# Altium project DDS_PCB.PrjPcb
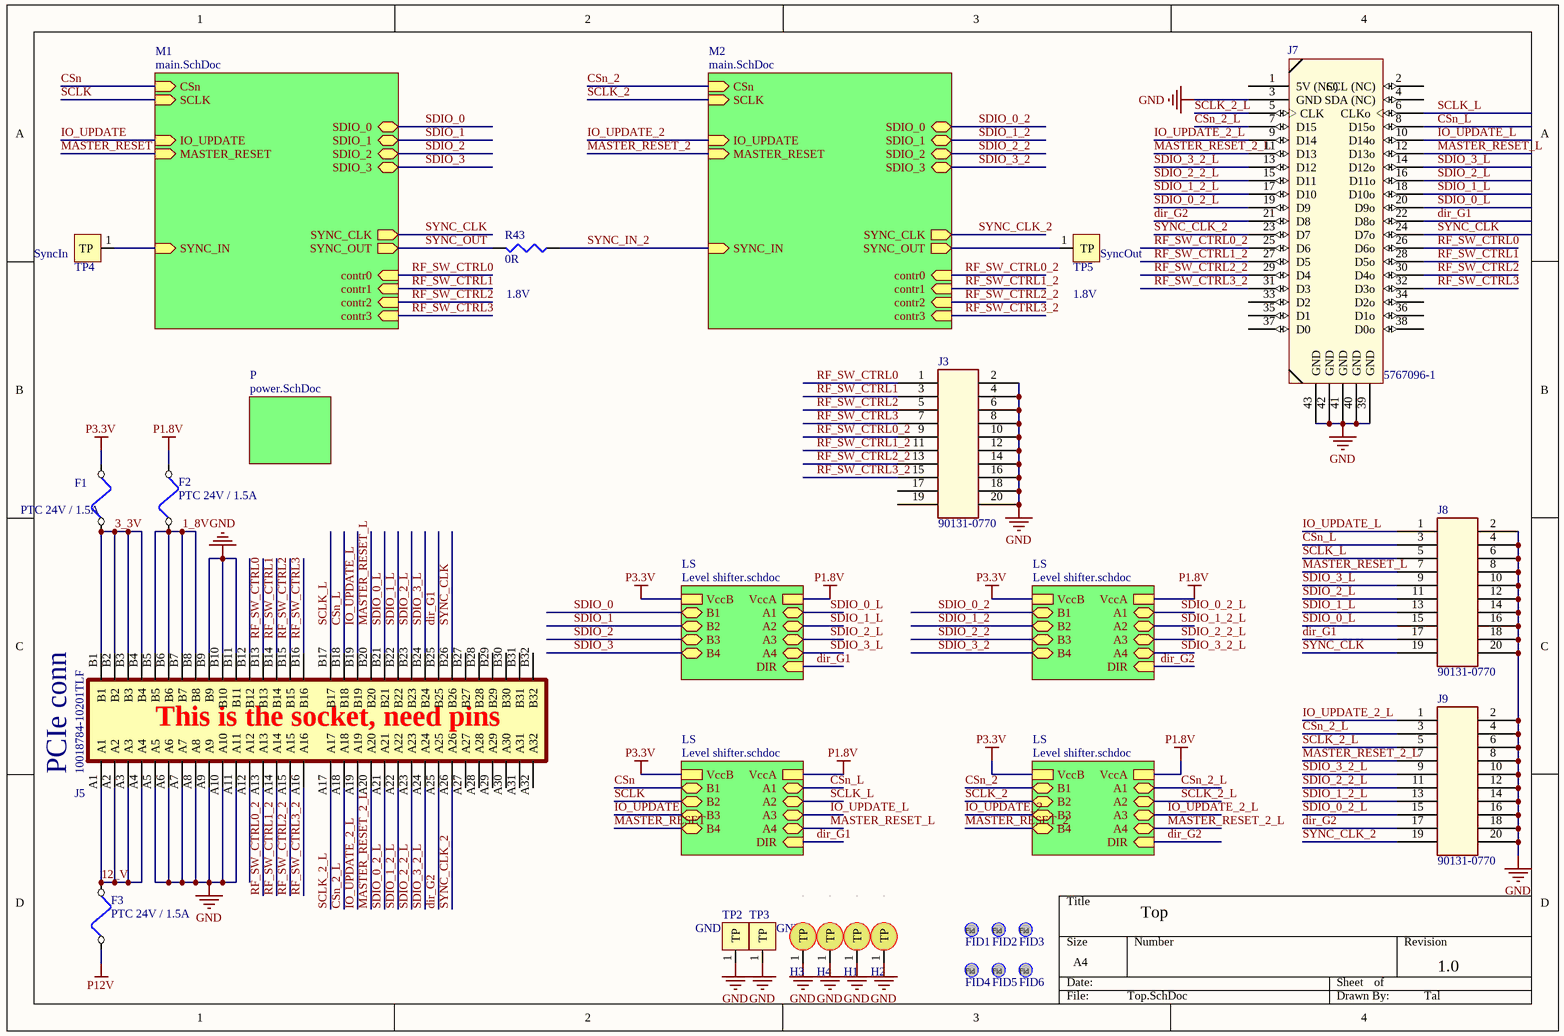
[diagram p0: Top.SchDoc]
4 sheets, 379 parts. Net scope: hierarchical (ports join the sheet entries above them; power ports are global).
Board file: DDS_PCB.PcbDoc
Sheets:
  Top.SchDoc
    M1 = main.SchDoc
      A0 = analog_channel.SchDoc
      A1 = analog_channel.SchDoc
      A2 = analog_channel3.SchDoc
      A3 = analog_channel3.SchDoc
    M2 = main.SchDoc
      A0 = analog_channel.SchDoc
      A1 = analog_channel.SchDoc
      A2 = analog_channel3.SchDoc
      A3 = analog_channel3.SchDoc

## Sheet Top.SchDoc
size A4; SheetNumber: 1; SheetTotal: 6

### Parts
F1  PTC 24V / 1.5A  [1812_F]
F2  PTC 24V / 1.5A  [1812_F]
F3  PTC 24V / 1.5A  [1812_F]
FID1  Fiducial  [Fiducial]  (value not drawn)
FID2  Fiducial  [Fiducial]  (value not drawn)
FID3  Fiducial  [Fiducial]  (value not drawn)
FID4  Fiducial  [Fiducial]  (value not drawn)
FID5  Fiducial  [Fiducial]  (value not drawn)
FID6  Fiducial  [Fiducial]  (value not drawn)
H1  Hole 3mm  [hole 3mm]  (value not drawn)
H2  Hole 3mm  [hole 3mm]  (value not drawn)
H3  Hole 3mm  [hole 3mm]  (value not drawn)
H4  Hole 3mm  [hole 3mm]  (value not drawn)
J3  90131-0770  [HEADER_10x2]
J5  10018784-10201TLF  [PCIE_8LANE_EDGE]
J7  5767096-1  [MICTOR-38_PIN]
J8  90131-0770  [HEADER_10x2]
J9  90131-0770  [HEADER_10x2]
R43  0R  [R0402]
TP2  GND  [TP_2x1.8]
TP3  GND  [TP_2x1.8]
TP4  SyncIn  [TP_2x1.8]
TP5  SyncOut  [TP_2x1.8]

### Sub-sheets
LS = Level shifter.schdoc (file not in this document): A4 (bidir), B3 (bidir), A2 (bidir), B1 (bidir), B4 (bidir), A1 (bidir), B2 (bidir), A3 (bidir), VccA, VccB, DIR (in)
LS = Level shifter.schdoc (file not in this document): A4 (bidir), B3 (bidir), A2 (bidir), B1 (bidir), B4 (bidir), A1 (bidir), B2 (bidir), A3 (bidir), VccA, VccB, DIR (in)
LS = Level shifter.schdoc (file not in this document): A4 (bidir), B3 (bidir), A2 (bidir), B1 (bidir), B4 (bidir), A1 (bidir), B2 (bidir), A3 (bidir), VccA, VccB, DIR (in)
LS = Level shifter.schdoc (file not in this document): A4 (bidir), B3 (bidir), A2 (bidir), B1 (bidir), B4 (bidir), A1 (bidir), B2 (bidir), A3 (bidir), VccA, VccB, DIR (in)
M1 = main.SchDoc: SYNC_CLK (out), SYNC_OUT (out), SDIO_0 (bidir), SDIO_1 (bidir), SDIO_2 (bidir), SDIO_3 (bidir), CSn (in), IO_UPDATE (in), MASTER_RESET (in), SCLK (in), SYNC_IN (in), contr0 (in), contr1 (in), contr2 (in), contr3 (in)
M2 = main.SchDoc: SYNC_CLK (out), SYNC_OUT (out), SDIO_0 (bidir), SDIO_1 (bidir), SDIO_2 (bidir), SDIO_3 (bidir), CSn (in), IO_UPDATE (in), MASTER_RESET (in), SCLK (in), SYNC_IN (in), contr0 (in), contr1 (in), contr2 (in), contr3 (in)
P = power.SchDoc (file not in this document): no entries

### Nets
GND: H1.1(TP) H2.1(TP) H3.1(TP) H4.1(TP) J3.2 J3.4 J3.6 J3.8 J3.10 J3.12 J3.14 J3.16 J3.18 J3.20 J5.A5 J5.A6 J5.A7 J5.A8 J5.A9 J5.A10 J5.A11 J5.B9 J5.B10 J5.B11 J7.3(GND) J7.39(GND) J7.40(GND) J7.41(GND) J7.42(GND) J7.43(GND) J8.2 J8.4 J8.6 J8.8 J8.10 J8.12 J8.14 J8.16 J8.18 J8.20 J9.2 J9.4 J9.6 J9.8 J9.10 J9.12 J9.14 J9.16 J9.18 J9.20 TP2.1(TP) TP3.1(TP)
P1.8V: F2.2 ; sheet LS/VccA, sheet LS/VccA, sheet LS/VccA, sheet LS/VccA
P3.3V: F1.2 ; sheet LS/VccB, sheet LS/VccB, sheet LS/VccB, sheet LS/VccB
P12V: F3.1
1_8V: F2.1 J5.B5 J5.B6 J5.B7 J5.B8
3_3V: F1.1 J5.B1 J5.B2 J5.B3 J5.B4
12_V: F3.2 J5.A1 J5.A2 J5.A3 J5.A4
CSn: sheet M1/CSn, sheet LS/B1
CSn_2: sheet M2/CSn, sheet LS/B1
CSn_2_L: J5.A18 J7.7(D15) J9.3 ; sheet LS/A1
CSn_L: J5.B18 J7.8(D15o) J8.3 ; sheet LS/A1
dir_G1: J5.B25 J7.22(D8o) J8.17 ; sheet LS/DIR, sheet LS/DIR
dir_G2: J5.A25 J7.21(D8) J9.17 ; sheet LS/DIR, sheet LS/DIR
IO_UPDATE: sheet M1/IO_UPDATE, sheet LS/B3
IO_UPDATE_2: sheet M2/IO_UPDATE, sheet LS/B3
IO_UPDATE_2_L: J5.A19 J7.9(D14) J9.1 ; sheet LS/A3
IO_UPDATE_L: J5.B19 J7.10(D14o) J8.1 ; sheet LS/A3
MASTER_RESET: sheet M1/MASTER_RESET, sheet LS/B4
MASTER_RESET_2: sheet M2/MASTER_RESET, sheet LS/B4
MASTER_RESET_2_L: J5.A20 J7.11(D13) J9.7 ; sheet LS/A4
MASTER_RESET_L: J5.B20 J7.12(D13o) J8.7 ; sheet LS/A4
RF_SW_CTRL0: J3.1 J5.B13 J7.26(D6o) ; sheet M1/contr0  [project net contr0]
RF_SW_CTRL0_2: J3.9 J5.A13 J7.25(D6) ; sheet M2/contr0  [project net contr0]
RF_SW_CTRL1: J3.3 J5.B14 J7.28(D5o) ; sheet M1/contr1  [project net contr1]
RF_SW_CTRL1_2: J3.11 J5.A14 J7.27(D5) ; sheet M2/contr1  [project net contr1]
RF_SW_CTRL2: J3.5 J5.B15 J7.30(D4o) ; sheet M1/contr2  [project net contr2]
RF_SW_CTRL2_2: J3.13 J5.A15 J7.29(D4) ; sheet M2/contr2  [project net contr2]
RF_SW_CTRL3: J3.7 J5.B16 J7.32(D3o) ; sheet M1/contr3  [project net contr3]
RF_SW_CTRL3_2: J3.15 J5.A16 J7.31(D3) ; sheet M2/contr3  [project net contr3]
SCLK: sheet M1/SCLK, sheet LS/B2
SCLK_2: sheet M2/SCLK, sheet LS/B2
SCLK_2_L: J5.A17 J7.5(CLK) J9.5 ; sheet LS/A2
SCLK_L: J5.B17 J7.6(CLKo) J8.5 ; sheet LS/A2
SDIO_0: sheet M1/SDIO_0, sheet LS/B1
SDIO_0_2: sheet M2/SDIO_0, sheet LS/B1
SDIO_0_2_L: J5.A21 J7.19(D9) J9.15 ; sheet LS/A1
SDIO_0_L: J5.B21 J7.20(D9o) J8.15 ; sheet LS/A1
SDIO_1: sheet M1/SDIO_1, sheet LS/B2
SDIO_1_2: sheet M2/SDIO_1, sheet LS/B2
SDIO_1_2_L: J5.A22 J7.17(D10) J9.13 ; sheet LS/A2
SDIO_1_L: J5.B22 J7.18(D10o) J8.13 ; sheet LS/A2
SDIO_2: sheet M1/SDIO_2, sheet LS/B3
SDIO_2_2: sheet M2/SDIO_2, sheet LS/B3
SDIO_2_2_L: J5.A23 J7.15(D11) J9.11 ; sheet LS/A3
SDIO_2_L: J5.B23 J7.16(D11o) J8.11 ; sheet LS/A3
SDIO_3: sheet M1/SDIO_3, sheet LS/B4
SDIO_3_2: sheet M2/SDIO_3, sheet LS/B4
SDIO_3_2_L: J5.A24 J7.13(D12) J9.9 ; sheet LS/A4
SDIO_3_L: J5.B24 J7.14(D12o) J8.9 ; sheet LS/A4
SYNC_CLK: J5.B26 J7.24(D7o) J8.19 ; sheet M1/SYNC_CLK
SYNC_CLK_2: J5.A26 J7.23(D7) J9.19 ; sheet M2/SYNC_CLK
SYNC_IN: TP4.1(TP) ; sheet M1/SYNC_IN
SYNC_IN_2: R43.1 ; sheet M2/SYNC_IN
SYNC_OUT: TP5.1(TP) ; sheet M2/SYNC_OUT
SYNC_OUT: R43.2 ; sheet M1/SYNC_OUT  [a separate net that carries the same name]

Not connected (* = marked no-connect by the designer): J3 17 19; J5 A12 A27 A28 A29 A30 A31 A32 B12 B27 B28 B29 B30 B31 B32; J7 1(5V_(NC)) 2(SCL_(NC)) 4(SDA_(NC)) 33(D2) 34(D2o) 35(D1) 36(D1o) 37(D0) 38(D0o)

### Notes on the sheet
- (near R43) 1.8V
- (near TP5) 1.8V
- (near J5) PCIe conn
- (near J5) This is the socket, need pins
- Top
- 1.0
- Tal
- (in symbol Fiducial) Fid

### Library data of the parts
F1-F3 = 1812L150/24MR: FUSE PTC 24V 1.5A POLYFUSE 1812; Manufacturer: Littelfuse Inc; LANDA P/N: EFS-000011; Package / Case: 1812 (4532 Metric), Concave; RoHS: RoHS Compliant; Manufacturer Part Number: 1812L150/24MR; ComponentLink1URL: http://www.littelfuse.com/data/en/Data_Sheets/Littelfuse_PTC_1812L.pdf; ComponentLink1Description: http://www.littelfuse.com/data/en/Data_Sheets/Littelfuse_PTC_1812L.pdf; Current - Hold (Ih) (Max): 1.5A
FID1-FID6 = Fiducial: Assembly: NA
J3 J8 J9 = 90131-0770: CONN HEADER 20 TH; Manufacturer: Molex Connector Corporation; LANDA P/N: ECN-000005; RoHS: RoHS Compliant; Mounting Type: Through Hole; Contact Type: Male Pin; ComponentLink1URL: http://www.molex.com/pdm_docs/sd/901310770_sd.pdf; ComponentLink1Description: http://www.molex.com/pdm_docs/sd/901310770_sd.pdf; Manufacturer Part Number: 90131-0770
J5 = 10018784-10201TLF: 64 Position Female Connector PCI Expressâ„¢ Gold 0.039 _1.00mm_ Black; MF: Amphenol ICC; Price: None; Value: *; MP: 10018784-10201TLF; Package: None; SnapEDA_Link: https://www.snapeda.com/parts/10018784-10201TLF/Amphenol%20FCI/view-part/2598016/?ref=snap; Availability: Unavailable
J7 = 5767096-1: CONN MICTOR 38POS .025 VERT SMD; Manufacturer: TE Connectivity; LANDA P/N: ECN-000060; RoHS: RoHS Compliant; ComponentLink1URL: http://www.te.com/commerce/DocumentDelivery/DDEController?Action=srchrtrv&DocNm=5767096&DocType=Customer+Drawing&DocLang=English; ComponentLink1Description: http://www.te.com/commerce/DocumentDelivery/DDEController?Action=srchrtrv&DocNm=5767096&DocType=Customer+Drawing&DocLang=English; Manufacturer Part Number: 5767096-1
R43 = RES 100 OHM 1/10W 1% 0402 SMD: RES 0 OHM 1/10W 1% 0402 SMD; Manufacturer Part Number: ERJ-2RKF1000X; Manufacturer: Panasonic Electronic Components; LANDA P/N: ERS-000079; Assembly: N.C; Package / Case: 0402 (1005 Metric); RoHS: RoHS Compliant; ComponentLink1URL: http://industrial.panasonic.com/www-cgi/jvcr13pz.cgi?E+PZ+3+AOA0002+ERJ2RKF1000X+7+WW; ComponentLink1Description: http://industrial.panasonic.com/www-cgi/jvcr13pz.cgi?E+PZ+3+AOA0002+ERJ2RKF1000X+7+WW; Supplier Device Package: 0402
TP2 TP4 TP5 = TP mini_2: TP PC MINIATURE SMT; Manufacturer: Keystone Electronics; Manufacturer Part Number: 5015; Assembly: N.A; LANDA P/N: ECN-000032; RoHS: RoHS Compliant
TP3 = TP mini_1: TP PC MINIATURE SMT; Manufacturer: Keystone Electronics; Manufacturer Part Number: 5015; Assembly: N.A; LANDA P/N: ECN-000032; RoHS: RoHS Compliant

## Sheet main.SchDoc
size A4; SheetNumber: 2; SheetTotal: 6; SPICEModelCacheQOCYWOGJ: <root> / <DocumentId>QOCYWOGJ</DocumentId> / </root>
Used 2 times, as channels M1, M2. Parts and nets are listed once, with the designators drawn on the sheet.
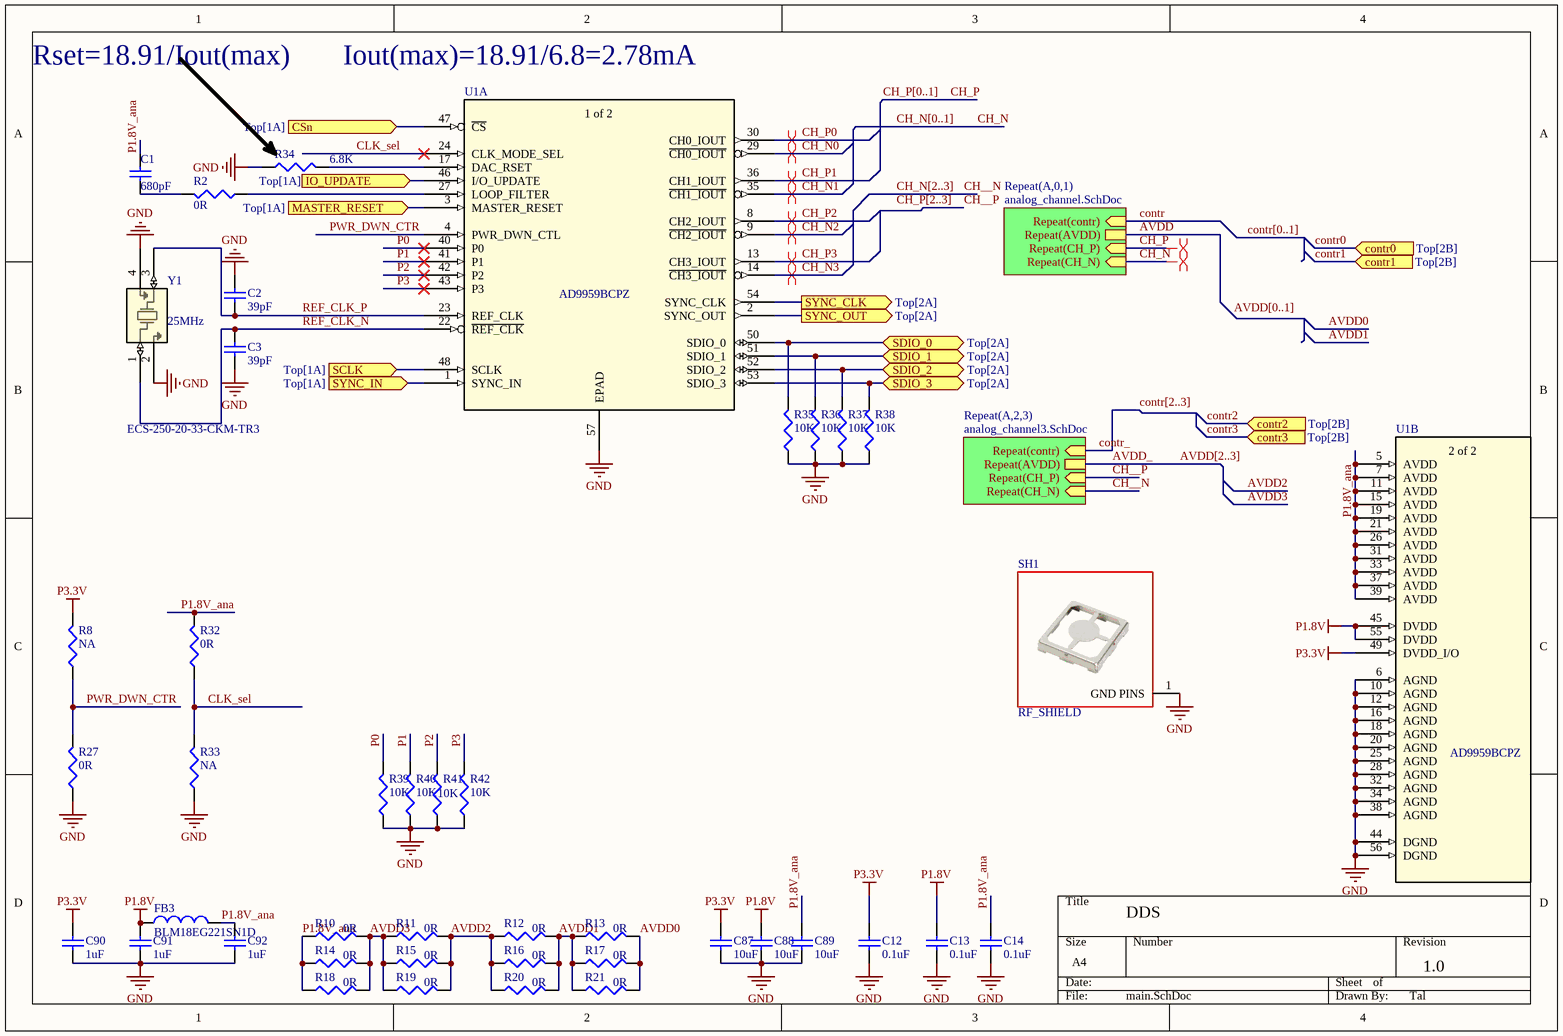
[diagram p1: main.SchDoc]

### Parts
C1  Capacitance: 680pF  [C0402]  (hidden comment: 680pF 50V)
C2  Capacitance: 39pF  [C0402]  (hidden comment: 39pF 50V)
C3  Capacitance: 39pF  [C0402]  (hidden comment: 39pF 50V)
C12  Capacitance: 0.1uF  [C0402]  (hidden comment: 0.1uF 50V)
C13  Capacitance: 0.1uF  [C0402]  (hidden comment: 0.1uF 50V)
C14  Capacitance: 0.1uF  [C0402]  (hidden comment: 0.1uF 50V)
C87  Capacitance: 10uF  [C0402]  (hidden comment: 10uF 10V)
C88  Capacitance: 10uF  [C0402]  (hidden comment: 10uF 10V)
C89  Capacitance: 10uF  [C0402]  (hidden comment: 10uF 10V)
C90  Capacitance: 1uF  [C0402]  (hidden comment: 1uF 25V)
C91  Capacitance: 1uF  [C0402]  (hidden comment: 1uF 25V)
C92  Capacitance: 1uF  [C0402]  (hidden comment: 1uF 25V)
FB3  BLM18EG221SN1D  [fb0603]
R2  0R  [R0402]
R8  NA  [R0402]
R10  0R  [R0805]
R11  0R  [R0805]
R12  0R  [R0805]
R13  0R  [R0805]
R14  0R  [R0805]
R15  0R  [R0805]
R16  0R  [R0805]
R17  0R  [R0805]
R18  0R  [R0805]
R19  0R  [R0805]
R20  0R  [R0805]
R21  0R  [R0805]
R27  0R  [R0402]
R32  0R  [R0402]
R33  NA  [R0402]
R34  6.8K  [R0402]
R35  10K  [R0402]
R36  10K  [R0402]
R37  10K  [R0402]
R38  10K  [R0402]
R39  10K  [R0402]
R40  10K  [R0402]
R41  10K  [R0402]
R42  10K  [R0402]
SH1  RF_SHIELD  [SMS201F]
U1  AD9959BCPZ  [CP_56_1_ADI]  (parts A,B of 2)
Y1  ECS-250-20-33-CKM-TR3  [SMD4_ECX-32_3p2x2p5_ECS]

### Sub-sheets
Repeat(A,0,1) = analog_channel.SchDoc: Repeat(contr) (in), Repeat(AVDD), Repeat(CH_P) (in), Repeat(CH_N) (in)
Repeat(A,2,3) = analog_channel3.SchDoc: Repeat(contr) (in), Repeat(AVDD), Repeat(CH_P) (in), Repeat(CH_N) (in)

### Ports
contr0 (in, see Top[2B]), contr1 (in, see Top[2B]), contr2 (in, see Top[2B]), contr3 (in, see Top[2B]), CSn (in, see Top[1A]), IO_UPDATE (in, see Top[1A]), MASTER_RESET (in, see Top[1A]), SCLK (in, see Top[1A]), SDIO_0 (bidir, see Top[2A]), SDIO_1 (bidir, see Top[2A]), SDIO_2 (bidir, see Top[2A]), SDIO_3 (bidir, see Top[2A]), SYNC_CLK (out, see Top[2A]), SYNC_IN (in, see Top[1A]), SYNC_OUT (out, see Top[2A])

### Nets
GND: C2.2 C3.1 C12.1 C13.1 C14.1 C87.1 C88.1 C89.1 C90.1 C91.1 C92.1 R27.1 R33.1 R34.1 R35.1 R36.1 R37.1 R38.1 R39.1 R40.1 R41.1 R42.1 SH1.1(GND_PINS) U1.6(AGND) U1.10(AGND) U1.12(AGND) U1.16(AGND) U1.18(AGND) U1.20(AGND) U1.25(AGND) U1.28(AGND) U1.32(AGND) U1.34(AGND) U1.38(AGND) U1.44(DGND) U1.56(DGND) U1.57(EPAD) Y1.2 Y1.4
P1.8V: C13.2 C88.2 C91.2 FB3.1 U1.45(DVDD) U1.55(DVDD)
P3.3V: C12.2 C87.2 C90.2 R8.2 U1.49(DVDD_I/O)
AVDD: sheet Repeat(A,0,1)/Repeat(AVDD)
AVDD0: R13.2 R17.2 R21.2
AVDD1: R12.2 R13.1 R16.2 R17.1 R20.2 R21.1
AVDD2: R11.2 R12.1 R15.2 R16.1 R19.2 R20.1
AVDD3: R10.2 R11.1 R14.2 R15.1 R18.2 R19.1
AVDD[2..3]: sheet Repeat(A,2,3)/Repeat(AVDD)  [also labelled AVDD_]
CH__N: sheet Repeat(A,2,3)/Repeat(CH_N)
CH__P: sheet Repeat(A,2,3)/Repeat(CH_P)
CH_N: sheet Repeat(A,0,1)/Repeat(CH_N)
CH_N0: U1.29(~{CH0_IOUT})
CH_N1: U1.35(~{CH1_IOUT})
CH_N2: U1.9(~{CH2_IOUT})
CH_N3: U1.14(~{CH3_IOUT})
CH_P: sheet Repeat(A,0,1)/Repeat(CH_P)
CH_P0: U1.30(CH0_IOUT)
CH_P1: U1.36(CH1_IOUT)
CH_P2: U1.8(CH2_IOUT)
CH_P3: U1.13(CH3_IOUT)
CLK_sel: R32.1 R33.2 U1.24(CLK_MODE_SEL)
contr: sheet Repeat(A,0,1)/Repeat(contr)
contr0: port contr0
contr1: port contr1
contr2: port contr2
contr3: port contr3
contr[2..3]: sheet Repeat(A,2,3)/Repeat(contr)  [also labelled contr_]
CSn: U1.47(~{CS}) ; port CSn
IO_UPDATE: U1.46(I/O_UPDATE) ; port IO_UPDATE
MASTER_RESET: U1.3(MASTER_RESET) ; port MASTER_RESET
P0: R39.2 U1.40(P0)
P1: R40.2 U1.41(P1)
P1.8V_ana: C1.1 C14.2 C89.2 C92.2 FB3.2 R10.1 R14.1 R18.1 R32.2 U1.5(AVDD) U1.7(AVDD) U1.11(AVDD) U1.15(AVDD) U1.19(AVDD) U1.21(AVDD) U1.26(AVDD) U1.31(AVDD) U1.33(AVDD) U1.37(AVDD) U1.39(AVDD)
P2: R41.2 U1.42(P2)
P3: R42.2 U1.43(P3)
PWR_DWN_CTR: R8.1 R27.2 U1.4(PWR_DWN_CTL)
REF_CLK_N: C3.2 U1.22(~{REF_CLK}) Y1.1
REF_CLK_P: C2.1 U1.23(REF_CLK) Y1.3
SCLK: U1.48(SCLK) ; port SCLK
SDIO_0: R35.2 U1.50(SDIO_0) ; port SDIO_0
SDIO_1: R36.2 U1.51(SDIO_1) ; port SDIO_1
SDIO_2: R37.2 U1.52(SDIO_2) ; port SDIO_2
SDIO_3: R38.2 U1.53(SDIO_3) ; port SDIO_3
SYNC_CLK: U1.54(SYNC_CLK) ; port SYNC_CLK
SYNC_IN: U1.1(SYNC_IN) ; port SYNC_IN
SYNC_OUT: U1.2(SYNC_OUT) ; port SYNC_OUT
NetC1_2: C1.2 R2.2
NetR2_1: R2.1 U1.27(LOOP_FILTER)
NetR34_2: R34.2 U1.17(DAC_RSET)

### Channels
M1: designators end in _M1; ports contr0=contr0 contr1=contr1 contr2=contr2 contr3=contr3 CSn=CSn IO_UPDATE=IO_UPDATE MASTER_RESET=MASTER_RESET SCLK=SCLK SDIO_0=SDIO_0 SDIO_1=SDIO_1 SDIO_2=SDIO_2 SDIO_3=SDIO_3 SYNC_CLK=SYNC_CLK SYNC_IN=SYNC_IN SYNC_OUT=SYNC_OUT
M2: designators end in _M2; ports contr0=contr0 contr1=contr1 contr2=contr2 contr3=contr3 CSn=CSn_2 IO_UPDATE=IO_UPDATE_2 MASTER_RESET=MASTER_RESET_2 SCLK=SCLK_2 SDIO_0=SDIO_0_2 SDIO_1=SDIO_1_2 SDIO_2=SDIO_2_2 SDIO_3=SDIO_3_2 SYNC_CLK=SYNC_CLK_2 SYNC_IN=SYNC_IN_2 SYNC_OUT=SYNC_OUT

### Buses and harness runs
bus AVDD[0..1]
bus CH_N[0..1]
bus CH_N[2..3]
bus CH_P[0..1]
bus CH_P[2..3]
bus contr[0..1]

### Layout directives
differential pair: CH_N, CH_N2_M1, CH_N3_M1, CH_N_M1, CH_P, CH_P2_M1, CH_P3_M1, CH_P_M1

### Notes on the sheet
- Rset=18.91/Iout(max)
- Iout(max)=18.91/6.8=2.78mA
- (near Y1) 25MHz
- DDS
- 1.0
- Tal
- Labels drawn without touching a wire or pin: CH_P[2..3]
- (in symbol AD9959BCPZ, part A) 1 of 2
- (in symbol AD9959BCPZ, part B) 2 of 2

### Library data of the parts
C1 = CAP CER 6.8pF 50V NP0 0402: CAP CER 680PF 50V NP0 0402; Manufacturer Part Number: C1005C0G1H6R8D; Manufacturer: TDK Corporation; LANDA P/N: ECP-000033; RoHS: RoHS Compliant; Package / Case: 0402 (1005 Metric); ComponentLink1URL: http://www.tdk.com/pdf/general_B11.pdf; ComponentLink1Description: http://www.tdk.com/pdf/general_B11.pdf; Voltage - Rated: 50V
C2 C3 = CAP CER 6.8pF 50V NP0 0402: CAP CER 39PF 50V NP0 0402; Manufacturer Part Number: C1005C0G1H6R8D; Manufacturer: TDK Corporation; LANDA P/N: ECP-000033; RoHS: RoHS Compliant; Package / Case: 0402 (1005 Metric); ComponentLink1URL: http://www.tdk.com/pdf/general_B11.pdf; ComponentLink1Description: http://www.tdk.com/pdf/general_B11.pdf; Voltage - Rated: 50V
C12-C14 = CAP CER 6.8pF 50V NP0 0402: CAP CER 0.1uF 50V NP0 0402; Manufacturer Part Number: C1005C0G1H6R8D; Manufacturer: TDK Corporation; LANDA P/N: ECP-000033; RoHS: RoHS Compliant; Package / Case: 0402 (1005 Metric); ComponentLink1URL: http://www.tdk.com/pdf/general_B11.pdf; ComponentLink1Description: http://www.tdk.com/pdf/general_B11.pdf; Voltage - Rated: 50V
C87-C89 = CAP CER 6.8pF 50V NP0 0402: CAP CER 10uF 10V X5R 0402; Manufacturer Part Number: C1005C0G1H6R8D; Manufacturer: TDK Corporation; LANDA P/N: ECP-000033; Voltage - Rated: 50V; RoHS: RoHS Compliant; Package / Case: 0402 (1005 Metric); ComponentLink1URL: http://www.tdk.com/pdf/general_B11.pdf; ComponentLink1Description: http://www.tdk.com/pdf/general_B11.pdf
C90-C92 = CAP CER 6.8pF 50V NP0 0402: CAP CER 1uF 25V X5R 0402; Manufacturer Part Number: C1005C0G1H6R8D; Manufacturer: TDK Corporation; LANDA P/N: ECP-000033; Voltage - Rated: 50V; RoHS: RoHS Compliant; Package / Case: 0402 (1005 Metric); ComponentLink1URL: http://www.tdk.com/pdf/general_B11.pdf; ComponentLink1Description: http://www.tdk.com/pdf/general_B11.pdf
FB3 = BK1608HS600-T: FERRITE BEAD 220_OHM@100MHz 0603 2A 50mohm_DC; Manufacturer: Taiyo Yuden; LANDA P/N: EIN-000010; RoHS: RoHS Compliant; Package / Case: 0603 (1608 Metric); ComponentLink1URL: http://www.yuden.co.jp/ut/product/category/emisuppression/BK1608HS600-T.pdf; ComponentLink1Description: http://www.yuden.co.jp/ut/product/category/emisuppression/BK1608HS600-T.pdf; Manufacturer Part Number: BLM18EG221SN1D
R2 R8 R27 R32 R33 = RES 100 OHM 1/10W 1% 0402 SMD: as R43 on sheet Top; Package / Case: 0402 (1005 Metric); RoHS: RoHS Compliant; ComponentLink1URL: http://industrial.panasonic.com/www-cgi/jvcr13pz.cgi?E+PZ+3+AOA0002+ERJ2RKF1000X+7+WW; ComponentLink1Description: http://industrial.panasonic.com/www-cgi/jvcr13pz.cgi?E+PZ+3+AOA0002+ERJ2RKF1000X+7+WW; Supplier Device Package: 0402
R10-R21 = RES 200 OHM 1/8W 1% 0805 SMD: RES 0 OHM 1/8W 1% 0805 SMD; Manufacturer Part Number: RMCF0805FT200R; Manufacturer: Stackpole Electronics Inc; Power (Watts): 0.125W, 1/8W; LANDA P/N: ERS-000050; Package / Case: 0805 (2012 Metric); RoHS: RoHS Compliant; Supplier Device Package: 0805; ComponentLink1URL: http://www.seielect.com/Catalog/SEI-RMCF_RMCP.pdf; ComponentLink1Description: http://www.seielect.com/Catalog/SEI-RMCF_RMCP.pdf
R34 = RES 3.09K OHM 1/16W 1% 0402: RES 6.8K OHM 1/16W 1% 0402; Manufacturer Part Number: RMCF0402FT3K09; Manufacturer: Stackpole Electronics Inc; Power (Watts): 0.063W, 1/16W; LANDA P/N: ERS-000063; Supplier Device Package: 0402; Package / Case: 0402 (1005 Metric); RoHS: RoHS Compliant; ComponentLink1URL: http://www.seielect.com/Catalog/SEI-RMCF_RMCP.pdf; ComponentLink1Description: http://www.seielect.com/Catalog/SEI-RMCF_RMCP.pdf
R35-R42 = RES 3.09K OHM 1/16W 1% 0402: RES 10K OHM 1/16W 1% 0402; Manufacturer Part Number: RMCF0402FT3K09; Manufacturer: Stackpole Electronics Inc; Power (Watts): 0.063W, 1/16W; LANDA P/N: ERS-000063; Supplier Device Package: 0402; Package / Case: 0402 (1005 Metric); RoHS: RoHS Compliant; ComponentLink1URL: http://www.seielect.com/Catalog/SEI-RMCF_RMCP.pdf; ComponentLink1Description: http://www.seielect.com/Catalog/SEI-RMCF_RMCP.pdf
SH1 = RF_SHIELD: RF SHIELD 0.5" X 0.538" SMD; Manufacturer_Part_Number: SMS-201F; Manufacturer: Leader Tech Inc.; ComponentLink1Description: Datasheet; ComponentLink1URL: https://www.leadertechinc.com/assets/files/EngineeringDrawings/SMS-201.pdf
U1 = AD9959BCPZ: No Description Available; Mfr_Name: Analog Devices Inc; Copyright: Copyright (C) 2023 Ultra Librarian. All rights reserved.; Manufacturer_Part_Number: AD9959BCPZ; RefDes: RefDes; Type: DEV
Y1 = ECS-250-20-33-CKM-TR3: No Description Available; Mfr_Name: ECS International; Type: DEV; Copyright: Copyright (C) 2023 Ultra Librarian. All rights reserved.; Manufacturer_Part_Number: ECS-250-20-33-CKM-TR3; RefDes: RefDes

## Sheet analog_channel.SchDoc
size A4; SheetNumber: 4; SheetTotal: 6
Used 4 times, as channels M1/A0, M1/A1, M2/A0, M2/A1. Parts and nets are listed once, with the designators drawn on the sheet.
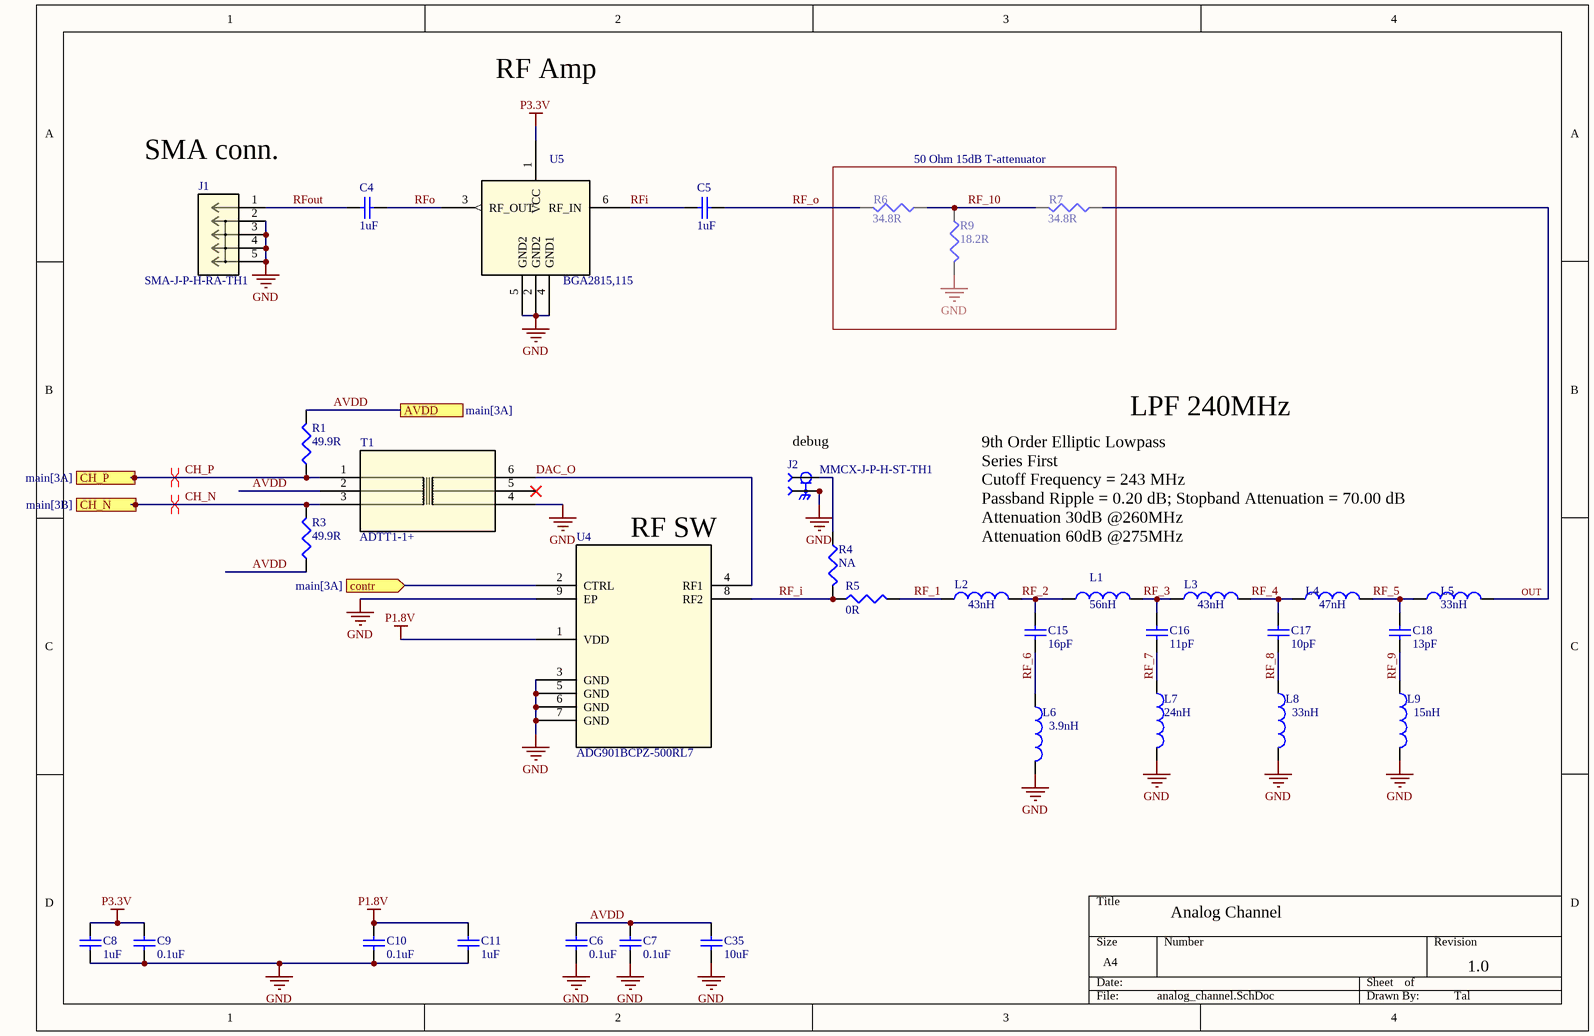
[diagram p2: analog_channel.SchDoc]

### Parts
C4  Capacitance: 1uF  [C0402]  (hidden comment: 1uF 25V)
C5  Capacitance: 1uF  [C0402]  (hidden comment: 1uF 25V)
C6  Capacitance: 0.1uF  [C0402]  (hidden comment: 0.1uF 50V)
C7  Capacitance: 0.1uF  [C0402]  (hidden comment: 0.1uF 50V)
C8  Capacitance: 1uF  [C0402]  (hidden comment: 1uF 25V)
C9  Capacitance: 0.1uF  [C0402]  (hidden comment: 0.1uF 50V)
C10  Capacitance: 0.1uF  [C0402]  (hidden comment: 0.1uF 50V)
C11  Capacitance: 1uF  [C0402]  (hidden comment: 1uF 25V)
C15  Capacitance: 16pF  [C0402]  (hidden comment: 16pF 50V)
C16  Capacitance: 11pF  [C0402]  (hidden comment: 11pF 50V)
C17  Capacitance: 10pF  [C0402]  (hidden comment: 10pF 50V)
C18  Capacitance: 13pF  [C0402]  (hidden comment: 13pF 50V)
C35  Capacitance: 10uF  [C0402]  (hidden comment: 10uF 10V)
J1  SMA-J-P-H-RA-TH1  [CONN_SMA-J-P-H-RA-TH1_SAI]
J2  MMCX-J-P-H-ST-TH1  [SAMTEC_MMCX-J-P-H-ST-TH1]
L1  value 56nH  [0402-A]  (hidden comment: Inductor)
L2  value 43nH  [0402-A]  (hidden comment: Inductor)
L3  value 43nH  [0402-A]  (hidden comment: Inductor)
L4  value 47nH  [0402-A]  (hidden comment: Inductor)
L5  value 33nH  [0402-A]  (hidden comment: Inductor)
L6  value 3.9nH  [0402-A]  (hidden comment: Inductor)
L7  value 24nH  [0402-A]  (hidden comment: Inductor)
L8  value 33nH  [0402-A]  (hidden comment: Inductor)
L9  value 15nH  [0402-A]  (hidden comment: Inductor)
R1  49.9R  [R0402]
R3  49.9R  [R0402]
R4  NA  [r0402]
R5  0R  [r0402]
R6  34.8R  [r0402]
R7  34.8R  [r0402]
R9  18.2R  [r0402]
T1  ADTT1-1+  [CD542_MNC]
U4  ADG901BCPZ-500RL7  [CP_8_2_ADI]
U5  BGA2815,115  [SOT_2815,115_NXP]

### Blocks framed on the sheet
50 Ohm 15dB T-attenuator: R6 R7 R9

### Ports
AVDD (see main[3A]), CH_N (in, see main[3B]), CH_P (in, see main[3A]), contr (in, see main[3A])

### Nets
GND: C6.1 C7.1 C8.1 C9.1 C10.1 C11.1 C35.1 J1.2 J1.3 J1.4 J1.5 J2.S1 J2.S2 J2.S3 J2.S4 L6.2 L7.2 L8.2 L9.2 R9.2 T1.4 U4.3(GND) U4.5(GND) U4.6(GND) U4.7(GND) U4.9(EP) U5.2(GND2) U5.4(GND1) U5.5(GND2)
P1.8V: C10.2 C11.2 U4.1(VDD)
P3.3V: C8.2 C9.2 U5.1(VCC)
AVDD: C6.2 C7.2 C35.2 R1.2 R3.1 T1.2 ; port AVDD
CH_N: R3.2 T1.3 ; port CH_N
CH_P: R1.1 T1.1 ; port CH_P
contr: U4.2(CTRL) ; port contr
DAC_O: T1.6 U4.4(RF1)
OUT: L5.2 R7.1
RF_1: L2.1 R5.2
RF_2: C15.1 L1.1 L2.2
RF_3: C16.1 L1.2 L3.1
RF_4: C17.1 L3.2 L4.1
RF_5: C18.1 L4.2 L5.1
RF_6: C15.2 L6.1
RF_7: C16.2 L7.1
RF_8: C17.2 L8.1
RF_9: C18.2 L9.1
RF_10: R6.1 R7.2 R9.1
RF_i: R4.2 R5.1 U4.8(RF2)
RF_o: C5.2 R6.2
RFi: C5.1 U5.6(RF_IN)
RFo: C4.2 U5.3(RF_OUT)
RFout: C4.1 J1.1
NetJ2_1: J2.1 R4.1

Not connected (* = marked no-connect by the designer): T1 5*

### Channels
M1/A0: designators end in _M1_A0; ports AVDD=AVDD CH_N=CH_N CH_P=CH_P contr=contr0
M1/A1: designators end in _M1_A1; ports AVDD=AVDD CH_N=CH_N CH_P=CH_P contr=contr1
M2/A0: designators end in _M2_A0; ports AVDD=AVDD CH_N=CH_N CH_P=CH_P contr=contr0
M2/A1: designators end in _M2_A1; ports AVDD=AVDD CH_N=CH_N CH_P=CH_P contr=contr1

### Layout directives
differential pair: CH_N, CH_P

### Notes on the sheet
- RF Amp
- (near J1) SMA conn.
- (near J2) debug
- LPF 240MHz
- (near U4) RF SW
- 9th Order Elliptic Lowpass
  Series First
  Cutoff Frequency = 243 MHz
  Passband Ripple = 0.20 dB; Stopband Attenuation = 70.00 dB
  Attenuation 30dB @260MHz
  Attenuation 60dB @275MHz
- Analog Channel
- 1.0
- Tal

### Library data of the parts
C4 C5 C8 C11 = CAP CER 6.8pF 50V NP0 0402: as C90 on sheet main; RoHS: RoHS Compliant; Package / Case: 0402 (1005 Metric); ComponentLink1URL: http://www.tdk.com/pdf/general_B11.pdf; ComponentLink1Description: http://www.tdk.com/pdf/general_B11.pdf
C6 C7 C9 C10 = CAP CER 6.8pF 50V NP0 0402: as C12 on sheet main; RoHS: RoHS Compliant; Package / Case: 0402 (1005 Metric); ComponentLink1URL: http://www.tdk.com/pdf/general_B11.pdf; ComponentLink1Description: http://www.tdk.com/pdf/general_B11.pdf; Voltage - Rated: 50V
C15 = CAP CER 20pF 50V 5% NP0 0402: CAP CER 16PF 50V 5% NP0 0402; Manufacturer: TDK Corporation; Manufacturer Part Number: C1005C0G1H200J; LANDA P/N: ECP-000034; Package / Case: 0402 (1005 Metric); RoHS: RoHS Compliant; ComponentLink1URL: http://www.tdk.com/pdf/general_B11.pdf; ComponentLink1Description: http://www.tdk.com/pdf/general_B11.pdf; Voltage - Rated: 50V
C16 = CAP CER 20pF 50V 5% NP0 0402: CAP CER 11PF 50V 5% NP0 0402; Manufacturer: TDK Corporation; Manufacturer Part Number: C1005C0G1H200J; LANDA P/N: ECP-000034; Package / Case: 0402 (1005 Metric); RoHS: RoHS Compliant; ComponentLink1URL: http://www.tdk.com/pdf/general_B11.pdf; ComponentLink1Description: http://www.tdk.com/pdf/general_B11.pdf; Voltage - Rated: 50V
C17 = CAP CER 20pF 50V 5% NP0 0402: CAP CER 10PF 50V 5% NP0 0402; Manufacturer: TDK Corporation; Manufacturer Part Number: C1005C0G1H200J; LANDA P/N: ECP-000034; Package / Case: 0402 (1005 Metric); RoHS: RoHS Compliant; ComponentLink1URL: http://www.tdk.com/pdf/general_B11.pdf; ComponentLink1Description: http://www.tdk.com/pdf/general_B11.pdf; Voltage - Rated: 50V
C18 = CAP CER 20pF 50V 5% NP0 0402: CAP CER 13PF 50V 5% NP0 0402; Manufacturer: TDK Corporation; Manufacturer Part Number: C1005C0G1H200J; LANDA P/N: ECP-000034; Package / Case: 0402 (1005 Metric); RoHS: RoHS Compliant; ComponentLink1URL: http://www.tdk.com/pdf/general_B11.pdf; ComponentLink1Description: http://www.tdk.com/pdf/general_B11.pdf; Voltage - Rated: 50V
C35 = CAP CER 6.8pF 50V NP0 0402: as C87 on sheet main; RoHS: RoHS Compliant; Package / Case: 0402 (1005 Metric); ComponentLink1URL: http://www.tdk.com/pdf/general_B11.pdf; ComponentLink1Description: http://www.tdk.com/pdf/general_B11.pdf
J1 = SMA-J-P-H-RA-TH1: No Description Available; Mfr_Name: Samtec Inc; Copyright: Copyright (C) 2023 Ultra Librarian. All rights reserved.; Manufacturer_Part_Number: SMA-J-P-H-RA-TH1; RefDes: RefDes; Type: DEV
J2 = MMCX-J-P-H-ST-TH1: MMCX STRAIGHT, THROUGH HOLE JACK- 50 OHM; MF: Samtec; MP: MMCX-J-P-H-ST-TH1; Price: None; Package: None; Value: *; Availability: Unavailable
L1-L9 = Inductor: Code_IEC: 1005; Published: 8-Jun-2000; LatestRevisionDate: 29-May-2009; LatestRevisionNote: IPC-7351 Footprint Added.; PackageReference: 0402-A; Publisher: Altium Limited; PackageDescription: Chip Inductor; Code_JEITA: 0402
R1 R3 = RES 100 OHM 1/10W 1% 0402 SMD: RES 49.9 OHM 1/10W 1% 0402 SMD; Manufacturer Part Number: ERJ-2RKF1000X; Manufacturer: Panasonic Electronic Components; LANDA P/N: ERS-000079; Assembly: N.C; Package / Case: 0402 (1005 Metric); RoHS: RoHS Compliant; ComponentLink1URL: http://industrial.panasonic.com/www-cgi/jvcr13pz.cgi?E+PZ+3+AOA0002+ERJ2RKF1000X+7+WW; ComponentLink1Description: http://industrial.panasonic.com/www-cgi/jvcr13pz.cgi?E+PZ+3+AOA0002+ERJ2RKF1000X+7+WW; Supplier Device Package: 0402
R4 R5 = RES 100 OHM 1/10W 1% 0402 SMD: as R43 on sheet Top; Package / Case: 0402 (1005 Metric); RoHS: RoHS Compliant; ComponentLink1URL: http://industrial.panasonic.com/www-cgi/jvcr13pz.cgi?E+PZ+3+AOA0002+ERJ2RKF1000X+7+WW; ComponentLink1Description: http://industrial.panasonic.com/www-cgi/jvcr13pz.cgi?E+PZ+3+AOA0002+ERJ2RKF1000X+7+WW; Supplier Device Package: 0402
R6 R7 = RES 100 OHM 1/10W 1% 0402 SMD: RES 34.8 OHM 1/10W 1% 0402 SMD; Manufacturer Part Number: ERJ-2RKF1000X; Manufacturer: Panasonic Electronic Components; LANDA P/N: ERS-000079; Assembly: N.C; Package / Case: 0402 (1005 Metric); RoHS: RoHS Compliant; ComponentLink1URL: http://industrial.panasonic.com/www-cgi/jvcr13pz.cgi?E+PZ+3+AOA0002+ERJ2RKF1000X+7+WW; ComponentLink1Description: http://industrial.panasonic.com/www-cgi/jvcr13pz.cgi?E+PZ+3+AOA0002+ERJ2RKF1000X+7+WW; Supplier Device Package: 0402
R9 = RES 100 OHM 1/10W 1% 0402 SMD: RES 18.2 OHM 1/10W 1% 0402 SMD; Manufacturer Part Number: ERJ-2RKF1000X; Manufacturer: Panasonic Electronic Components; LANDA P/N: ERS-000079; Assembly: N.C; Package / Case: 0402 (1005 Metric); RoHS: RoHS Compliant; ComponentLink1URL: http://industrial.panasonic.com/www-cgi/jvcr13pz.cgi?E+PZ+3+AOA0002+ERJ2RKF1000X+7+WW; ComponentLink1Description: http://industrial.panasonic.com/www-cgi/jvcr13pz.cgi?E+PZ+3+AOA0002+ERJ2RKF1000X+7+WW; Supplier Device Package: 0402
T1 = ADTT1-1+: No Description Available; Mfr_Name: Mini Circuits; Type: DEV; Copyright: Copyright (C) 2023 Ultra Librarian. All rights reserved.; Manufacturer_Part_Number: ADTT1-1+; RefDes: RefDes
U4 = ADG901BCPZ-500RL7: No Description Available; Mfr_Name: Analog Devices Inc; Copyright: Copyright (C) 2023 Ultra Librarian. All rights reserved.; Manufacturer_Part_Number: ADG901BCPZ-500RL7; RefDes: RefDes; Type: DEV
U5 = BGA2815,115: No Description Available; Mfr_Name: NXP; Copyright: Copyright (C) 2023 Ultra Librarian. All rights reserved.; Manufacturer_Part_Number: BGA2815,115; RefDes: RefDes; Type: DEV

## Sheet analog_channel3.SchDoc
size A4; SheetNumber: 6; SheetTotal: 6
Used 4 times, as channels M1/A2, M1/A3, M2/A2, M2/A3. Parts and nets are listed once, with the designators drawn on the sheet.
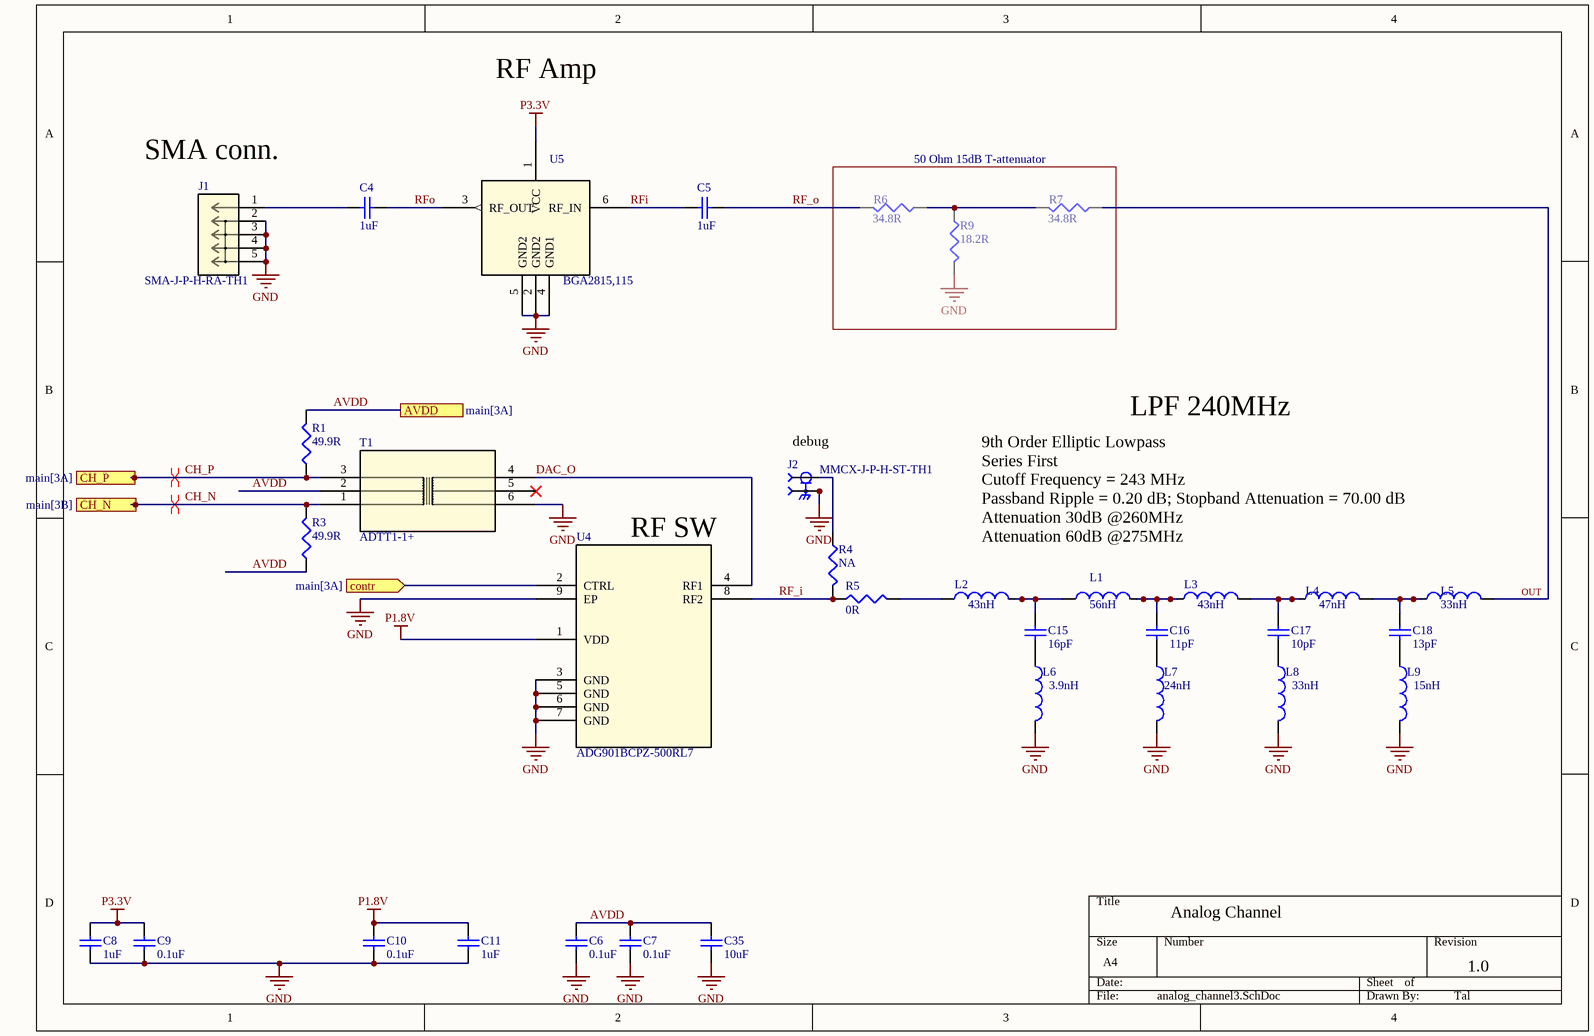
[diagram p3: analog_channel3.SchDoc]

### Parts
C4  Capacitance: 1uF  [C0402]  (hidden comment: 1uF 25V)
C5  Capacitance: 1uF  [C0402]  (hidden comment: 1uF 25V)
C6  Capacitance: 0.1uF  [C0402]  (hidden comment: 0.1uF 50V)
C7  Capacitance: 0.1uF  [C0402]  (hidden comment: 0.1uF 50V)
C8  Capacitance: 1uF  [C0402]  (hidden comment: 1uF 25V)
C9  Capacitance: 0.1uF  [C0402]  (hidden comment: 0.1uF 50V)
C10  Capacitance: 0.1uF  [C0402]  (hidden comment: 0.1uF 50V)
C11  Capacitance: 1uF  [C0402]  (hidden comment: 1uF 25V)
C15  Capacitance: 16pF  [C0402]  (hidden comment: 16pF 50V)
C16  Capacitance: 11pF  [C0402]  (hidden comment: 11pF 50V)
C17  Capacitance: 10pF  [C0402]  (hidden comment: 10pF 50V)
C18  Capacitance: 13pF  [C0402]  (hidden comment: 13pF 50V)
C35  Capacitance: 10uF  [C0402]  (hidden comment: 10uF 10V)
J1  SMA-J-P-H-RA-TH1  [CONN_SMA-J-P-H-RA-TH1_SAI]
J2  MMCX-J-P-H-ST-TH1  [SAMTEC_MMCX-J-P-H-ST-TH1]
L1  value 56nH  [0402-A]  (hidden comment: Inductor)
L2  value 43nH  [0402-A]  (hidden comment: Inductor)
L3  value 43nH  [0402-A]  (hidden comment: Inductor)
L4  value 47nH  [0402-A]  (hidden comment: Inductor)
L5  value 33nH  [0402-A]  (hidden comment: Inductor)
L6  value 3.9nH  [0402-A]  (hidden comment: Inductor)
L7  value 24nH  [0402-A]  (hidden comment: Inductor)
L8  value 33nH  [0402-A]  (hidden comment: Inductor)
L9  value 15nH  [0402-A]  (hidden comment: Inductor)
R1  49.9R  [R0402]
R3  49.9R  [R0402]
R4  NA  [r0402]
R5  0R  [r0402]
R6  34.8R  [r0402]
R7  34.8R  [r0402]
R9  18.2R  [r0402]
T1  ADTT1-1+  [CD542_MNC]
U4  ADG901BCPZ-500RL7  [CP_8_2_ADI]
U5  BGA2815,115  [SOT_2815,115_NXP]

### Blocks framed on the sheet
50 Ohm 15dB T-attenuator: R6 R7 R9

### Ports
AVDD (see main[3A]), CH_N (in, see main[3B]), CH_P (in, see main[3A]), contr (in, see main[3A])

### Nets
GND: C6.1 C7.1 C8.1 C9.1 C10.1 C11.1 C35.1 J1.2 J1.3 J1.4 J1.5 J2.S1 J2.S2 J2.S3 J2.S4 L6.2 L7.2 L8.2 L9.2 R9.2 T1.6 U4.3(GND) U4.5(GND) U4.6(GND) U4.7(GND) U4.9(EP) U5.2(GND2) U5.4(GND1) U5.5(GND2)
P1.8V: C10.2 C11.2 U4.1(VDD)
P3.3V: C8.2 C9.2 U5.1(VCC)
AVDD: C6.2 C7.2 C35.2 R1.2 R3.1 T1.2 ; port AVDD
CH_N: R3.2 T1.1 ; port CH_N
CH_P: R1.1 T1.3 ; port CH_P
contr: U4.2(CTRL) ; port contr
DAC_O: T1.4 U4.4(RF1)
OUT: L5.2 R7.1
RF_i: R4.2 R5.1 U4.8(RF2)
RF_o: C5.2 R6.2
RFi: C5.1 U5.6(RF_IN)
RFo: C4.2 U5.3(RF_OUT)
NetC4_1: C4.1 J1.1
NetC15_1: C15.1 L1.1 L2.2
NetC15_2: C15.2 L6.1
NetC16_1: C16.1 L1.2 L3.1
NetC16_2: C16.2 L7.1
NetC17_1: C17.1 L3.2 L4.1
NetC17_2: C17.2 L8.1
NetC18_1: C18.1 L4.2 L5.1
NetC18_2: C18.2 L9.1
NetJ2_1: J2.1 R4.1
NetL2_1: L2.1 R5.2
NetR6_1: R6.1 R7.2 R9.1

Not connected (* = marked no-connect by the designer): T1 5*

### Channels
M1/A2: designators end in _M1_A2; ports AVDD=AVDD_A2 CH_N=CH__N2_M1 CH_P=CH__P2_M1 contr=contr[2..3]2_M1
M1/A3: designators end in _M1_A3; ports AVDD=AVDD_A3 CH_N=CH__N3_M1 CH_P=CH__P3_M1 contr=contr[2..3]3_M1
M2/A2: designators end in _M2_A2; ports AVDD=AVDD_A2 CH_N=CH__N2_M2 CH_P=CH__P2_M2 contr=contr[2..3]2_M2
M2/A3: designators end in _M2_A3; ports AVDD=AVDD_A3 CH_N=CH__N3_M2 CH_P=CH__P3_M2 contr=contr[2..3]3_M2

### Layout directives
differential pair: CH__N2_M1, CH__P2_M1

### Notes on the sheet
- RF Amp
- (near J1) SMA conn.
- (near J2) debug
- LPF 240MHz
- (near U4) RF SW
- 9th Order Elliptic Lowpass
  Series First
  Cutoff Frequency = 243 MHz
  Passband Ripple = 0.20 dB; Stopband Attenuation = 70.00 dB
  Attenuation 30dB @260MHz
  Attenuation 60dB @275MHz
- Analog Channel
- 1.0
- Tal

### Library data of the parts
C4 C5 C8 C11 = CAP CER 6.8pF 50V NP0 0402: as C90 on sheet main; RoHS: RoHS Compliant; Package / Case: 0402 (1005 Metric); ComponentLink1URL: http://www.tdk.com/pdf/general_B11.pdf; ComponentLink1Description: http://www.tdk.com/pdf/general_B11.pdf
C6 C7 C9 C10 = CAP CER 6.8pF 50V NP0 0402: as C12 on sheet main; RoHS: RoHS Compliant; Package / Case: 0402 (1005 Metric); ComponentLink1URL: http://www.tdk.com/pdf/general_B11.pdf; ComponentLink1Description: http://www.tdk.com/pdf/general_B11.pdf; Voltage - Rated: 50V
C15 = CAP CER 20pF 50V 5% NP0 0402: as C15 on sheet analog_channel; Package / Case: 0402 (1005 Metric); RoHS: RoHS Compliant; ComponentLink1URL: http://www.tdk.com/pdf/general_B11.pdf; ComponentLink1Description: http://www.tdk.com/pdf/general_B11.pdf; Voltage - Rated: 50V
C16 = CAP CER 20pF 50V 5% NP0 0402: as C16 on sheet analog_channel; Package / Case: 0402 (1005 Metric); RoHS: RoHS Compliant; ComponentLink1URL: http://www.tdk.com/pdf/general_B11.pdf; ComponentLink1Description: http://www.tdk.com/pdf/general_B11.pdf; Voltage - Rated: 50V
C17 = CAP CER 20pF 50V 5% NP0 0402: as C17 on sheet analog_channel; Package / Case: 0402 (1005 Metric); RoHS: RoHS Compliant; ComponentLink1URL: http://www.tdk.com/pdf/general_B11.pdf; ComponentLink1Description: http://www.tdk.com/pdf/general_B11.pdf; Voltage - Rated: 50V
C18 = CAP CER 20pF 50V 5% NP0 0402: as C18 on sheet analog_channel; Package / Case: 0402 (1005 Metric); RoHS: RoHS Compliant; ComponentLink1URL: http://www.tdk.com/pdf/general_B11.pdf; ComponentLink1Description: http://www.tdk.com/pdf/general_B11.pdf; Voltage - Rated: 50V
C35 = CAP CER 6.8pF 50V NP0 0402: as C87 on sheet main; RoHS: RoHS Compliant; Package / Case: 0402 (1005 Metric); ComponentLink1URL: http://www.tdk.com/pdf/general_B11.pdf; ComponentLink1Description: http://www.tdk.com/pdf/general_B11.pdf
J1 = SMA-J-P-H-RA-TH1: as J1 on sheet analog_channel; Copyright: Copyright (C) 2023 Ultra Librarian. All rights reserved.; Manufacturer_Part_Number: SMA-J-P-H-RA-TH1; RefDes: RefDes; Type: DEV
J2 = MMCX-J-P-H-ST-TH1: as J2 on sheet analog_channel; MP: MMCX-J-P-H-ST-TH1; Price: None; Package: None; Value: *; Availability: Unavailable
L1-L9 = Inductor: Code_IEC: 1005; Published: 8-Jun-2000; LatestRevisionDate: 29-May-2009; LatestRevisionNote: IPC-7351 Footprint Added.; PackageReference: 0402-A; Publisher: Altium Limited; PackageDescription: Chip Inductor; Code_JEITA: 0402
R1 R3 = RES 100 OHM 1/10W 1% 0402 SMD: as R1 on sheet analog_channel; Package / Case: 0402 (1005 Metric); RoHS: RoHS Compliant; ComponentLink1URL: http://industrial.panasonic.com/www-cgi/jvcr13pz.cgi?E+PZ+3+AOA0002+ERJ2RKF1000X+7+WW; ComponentLink1Description: http://industrial.panasonic.com/www-cgi/jvcr13pz.cgi?E+PZ+3+AOA0002+ERJ2RKF1000X+7+WW; Supplier Device Package: 0402
R4 R5 = RES 100 OHM 1/10W 1% 0402 SMD: as R43 on sheet Top; Package / Case: 0402 (1005 Metric); RoHS: RoHS Compliant; ComponentLink1URL: http://industrial.panasonic.com/www-cgi/jvcr13pz.cgi?E+PZ+3+AOA0002+ERJ2RKF1000X+7+WW; ComponentLink1Description: http://industrial.panasonic.com/www-cgi/jvcr13pz.cgi?E+PZ+3+AOA0002+ERJ2RKF1000X+7+WW; Supplier Device Package: 0402
R6 R7 = RES 100 OHM 1/10W 1% 0402 SMD: as R6 on sheet analog_channel; Package / Case: 0402 (1005 Metric); RoHS: RoHS Compliant; ComponentLink1URL: http://industrial.panasonic.com/www-cgi/jvcr13pz.cgi?E+PZ+3+AOA0002+ERJ2RKF1000X+7+WW; ComponentLink1Description: http://industrial.panasonic.com/www-cgi/jvcr13pz.cgi?E+PZ+3+AOA0002+ERJ2RKF1000X+7+WW; Supplier Device Package: 0402
R9 = RES 100 OHM 1/10W 1% 0402 SMD: as R9 on sheet analog_channel; Package / Case: 0402 (1005 Metric); RoHS: RoHS Compliant; ComponentLink1URL: http://industrial.panasonic.com/www-cgi/jvcr13pz.cgi?E+PZ+3+AOA0002+ERJ2RKF1000X+7+WW; ComponentLink1Description: http://industrial.panasonic.com/www-cgi/jvcr13pz.cgi?E+PZ+3+AOA0002+ERJ2RKF1000X+7+WW; Supplier Device Package: 0402
T1 = ADTT1-1+: as T1 on sheet analog_channel; Copyright: Copyright (C) 2023 Ultra Librarian. All rights reserved.; Manufacturer_Part_Number: ADTT1-1+; RefDes: RefDes
U4 = ADG901BCPZ-500RL7: as U4 on sheet analog_channel; Copyright: Copyright (C) 2023 Ultra Librarian. All rights reserved.; Manufacturer_Part_Number: ADG901BCPZ-500RL7; RefDes: RefDes; Type: DEV
U5 = BGA2815,115: No Description Available; Mfr_Name: NXP; Copyright: Copyright (C) 2023 Ultra Librarian. All rights reserved.; Manufacturer_Part_Number: BGA2815,115; RefDes: RefDes; Type: DEV

## Nets that join several sheets
GND: Top (52 pins), M1 (39 pins), M1/A0 (29 pins), M1/A1 (29 pins), M1/A2 (29 pins), M1/A3 (29 pins), M2 (39 pins), M2/A0 (29 pins), M2/A1 (29 pins), M2/A2 (29 pins), M2/A3 (29 pins)
P1.8V: Top (F2.2), M1 (6 pins), M1/A0 (C10_M1_A0.2 C11_M1_A0.2 U4_M1_A0.1), M1/A1 (C10_M1_A1.2 C11_M1_A1.2 U4_M1_A1.1), M1/A2 (C10_M1_A2.2 C11_M1_A2.2 U4_M1_A2.1), M1/A3 (C10_M1_A3.2 C11_M1_A3.2 U4_M1_A3.1), M2 (6 pins), M2/A0 (C10_M2_A0.2 C11_M2_A0.2 U4_M2_A0.1), M2/A1 (C10_M2_A1.2 C11_M2_A1.2 U4_M2_A1.1), M2/A2 (C10_M2_A2.2 C11_M2_A2.2 U4_M2_A2.1), M2/A3 (C10_M2_A3.2 C11_M2_A3.2 U4_M2_A3.1)
P3.3V: Top (F1.2), M1 (5 pins), M1/A0 (C8_M1_A0.2 C9_M1_A0.2 U5_M1_A0.1), M1/A1 (C8_M1_A1.2 C9_M1_A1.2 U5_M1_A1.1), M1/A2 (C8_M1_A2.2 C9_M1_A2.2 U5_M1_A2.1), M1/A3 (C8_M1_A3.2 C9_M1_A3.2 U5_M1_A3.1), M2 (5 pins), M2/A0 (C8_M2_A0.2 C9_M2_A0.2 U5_M2_A0.1), M2/A1 (C8_M2_A1.2 C9_M2_A1.2 U5_M2_A1.1), M2/A2 (C8_M2_A2.2 C9_M2_A2.2 U5_M2_A2.1), M2/A3 (C8_M2_A3.2 C9_M2_A3.2 U5_M2_A3.1)
AVDD: M1 (6 pins), M1/A1 (6 pins)
AVDD: M1 (R13_M1.2 R17_M1.2 R21_M1.2), M1/A0 (6 pins)
AVDD: M2 (6 pins), M2/A1 (6 pins)
AVDD: M2 (R13_M2.2 R17_M2.2 R21_M2.2), M2/A0 (6 pins)
CH_N: M1 (U1_M1.29), M1/A0 (R3_M1_A0.2 T1_M1_A0.3)
CH_N: M1 (U1_M1.35), M1/A1 (R3_M1_A1.2 T1_M1_A1.3)
CH_N: M2 (U1_M2.29), M2/A0 (R3_M2_A0.2 T1_M2_A0.3)
CH_N: M2 (U1_M2.35), M2/A1 (R3_M2_A1.2 T1_M2_A1.3)
CH_P: M1 (U1_M1.30), M1/A0 (R1_M1_A0.1 T1_M1_A0.1)
CH_P: M1 (U1_M1.36), M1/A1 (R1_M1_A1.1 T1_M1_A1.1)
CH_P: M2 (U1_M2.30), M2/A0 (R1_M2_A0.1 T1_M2_A0.1)
CH_P: M2 (U1_M2.36), M2/A1 (R1_M2_A1.1 T1_M2_A1.1)
contr0: Top (J3.9 J5.A13 J7.25), M2/A0 (U4_M2_A0.2)
contr0: Top (J3.1 J5.B13 J7.26), M1/A0 (U4_M1_A0.2)
contr1: Top (J3.11 J5.A14 J7.27), M2/A1 (U4_M2_A1.2)
contr1: Top (J3.3 J5.B14 J7.28), M1/A1 (U4_M1_A1.2)
SYNC_CLK: Top (J5.B26 J7.24 J8.19), M1 (U1_M1.54)
SYNC_CLK_2: Top (J5.A26 J7.23 J9.19), M2 (U1_M2.54)
SYNC_IN: Top (TP4.1), M1 (U1_M1.1)
SYNC_IN_2: Top (R43.1), M2 (U1_M2.1)
SYNC_OUT: Top (TP5.1), M2 (U1_M2.2)
SYNC_OUT: Top (R43.2), M1 (U1_M1.2)